# Altium schematic sheet INA169.SchDoc
size A4
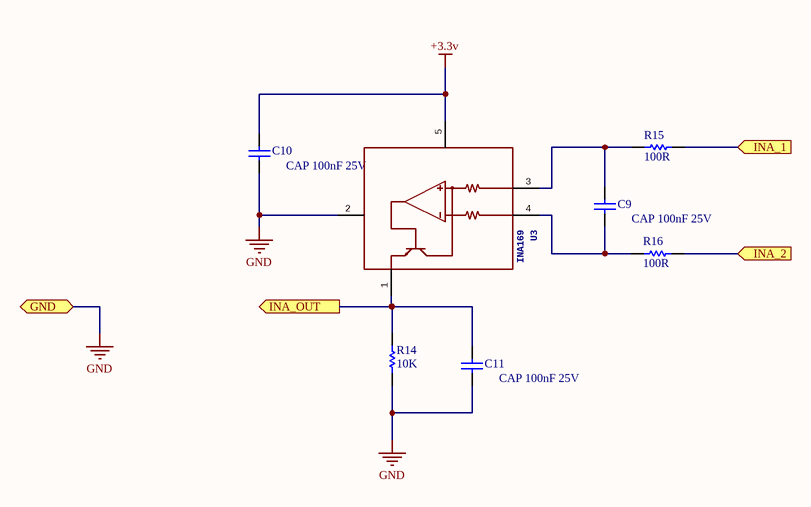
[diagram p0: INA169.SchDoc]

## Parts
C9  CAP 100nF 25V  [CAPC0402(1005)60_L]
C10  CAP 100nF 25V  [CAPC0402(1005)60_L]
C11  CAP 100nF 25V  [CAPC0402(1005)60_L]
R14  value 10K  [RES-0402]  (hidden comment: RC0402JR-071KL)
R15  value 100R  [RES-0402]  (hidden comment: RC0402JR-071KL)
R16  value 100R  [RES-0402]  (hidden comment: RC0402JR-071KL)
U3  INA169  [SOT23-5]

## Ports
GND (bidir), INA_1 (in), INA_2 (in), INA_OUT (out)

## Nets
+3.3v: C10.2 U3.5(V+)
GND: C10.1 C11.1 R14.1 U3.2(GND) ; port GND
INA_1: R15.2 ; port INA_1
INA_2: R16.2 ; port INA_2
INA_OUT: C11.2 R14.2 U3.1(OUT) ; port INA_OUT
NetC9_1: C9.1 R16.1 U3.4(VIN-)
NetC9_2: C9.2 R15.1 U3.3(VIN+)

## Library data of the parts
C9-C11 = CMP-1034-02073-1: CAP 100nF 25V ±20% 0402 (1005 Metric) Thickness 0.6mm SMD; Tolerance: Â±20%; Case-EIA: 0402; Case-Metric: 1005; Rated Voltage: 25 V; Value: 100nF; Max Thickness: 0.6 mm; Technology: SMT
R14 = RES 1K 0402: RES SMD 10K OHM 5% 1/16W 0402
R15 R16 = RES 1K 0402: RES SMD 100 OHM 5% 1/16W 0402
U3 = INA169: GateName_1: G$1; MF: Texas Instruments; SymbolName_1: INA169; LibraryName: INA169; DeviceSetName: INA169; Package: SOT23-5; Price: None; Availability: Unavailable; MP: INA169; Package: None